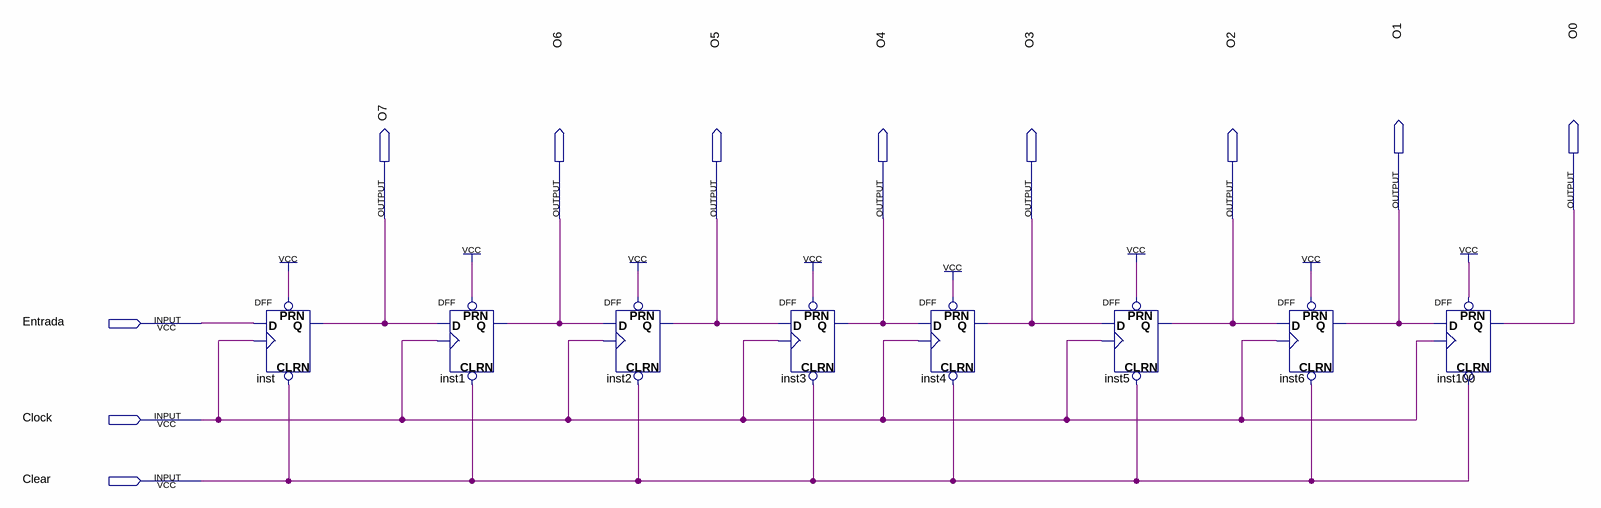
[diagram p0: schematic sheet]
// Quartus schematic RegistradorSIPO.bdf as structural Verilog: 8 symbols, 11 pins
module RegistradorSIPO (
  input  Entrada,
  input  Clock,
  input  Clear,
  output O1,
  output O0,
  output O7,
  output O6,
  output O5,
  output O4,
  output O3,
  output O2
);

  DFF inst (.CLRN(Clear), .CLK(Clock), .D(Entrada), .PRN(1'b1), .Q(O7));
  DFF inst1 (.CLRN(Clear), .CLK(Clock), .D(O7), .PRN(1'b1), .Q(O6));
  DFF inst2 (.CLRN(Clear), .CLK(Clock), .D(O6), .PRN(1'b1), .Q(O5));
  DFF inst3 (.CLRN(Clear), .CLK(Clock), .D(O5), .PRN(1'b1), .Q(O4));
  DFF inst4 (.CLRN(Clear), .CLK(Clock), .D(O4), .PRN(1'b1), .Q(O3));
  DFF inst5 (.CLRN(Clear), .CLK(Clock), .D(O3), .PRN(1'b1), .Q(O2));
  DFF inst6 (.CLRN(Clear), .CLK(Clock), .D(O2), .PRN(1'b1), .Q(O1));
  DFF inst100 (.CLRN(Clear), .CLK(Clock), .D(O1), .PRN(1'b1), .Q(O0));
endmodule
